# Altium schematic sheet Inductor.SchDoc
size A3; SheetNumber: 34; SheetTotal: 41
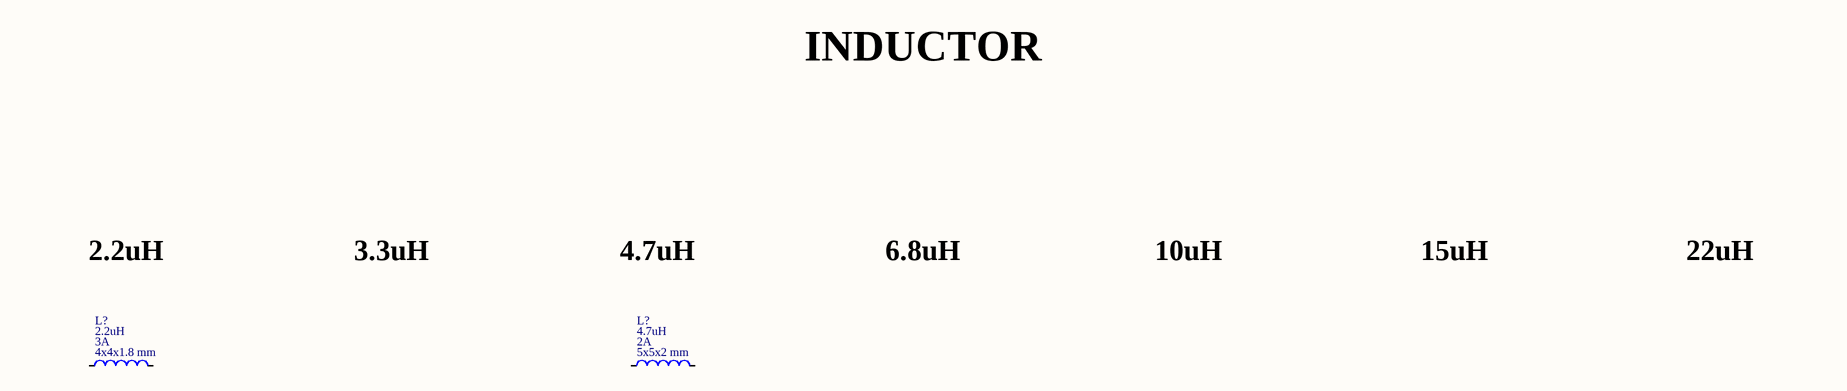
[diagram p0: Inductor.SchDoc]

## Parts
(Parts that share a designator on the sheet are numbered #1, #2 ... from top to bottom, then left to right.)
L?#1  value 2.2uH  Saturation Current: 3A  Package: 4x4x1.8 mm  [Taiyo Yuden - Power Inductor, 4040TK]  (hidden comment: Inductor)
L?#2  value 4.7uH  Saturation Current: 2A  Package: 5x5x2 mm  [Taiyo Yuden - Power Inductor, 5050WK]  (hidden comment: Inductor)

## Nets

Not connected (* = marked no-connect by the designer): L?#1 1 2; L?#2 1 2

## Notes on the sheet
- INDUCTOR
- 2.2uH
- 3.3uH
- 4.7uH
- 6.8uH
- 10uH
- 15uH
- 22uH

## Library data of the parts
L?#1 = Inductor: Inductor, Power, 2.2uH, 3A, 4x4x1.8mm; Manufacturer Part Number: NRS4018T2R2MDGJ; Manufacturer: Taiyo Yuden; ComponentLink1Description: Datasheet; ComponentLink1URL: E:\Altium\Datasheets\Inductor\Taiyo Yuden - NRx Series.pdf; ComponentLink2Description: Supplier Link; ComponentLink2URL: https://www.digikey.com/en/products/detail/taiyo-yuden/NRS4018T2R2MDGJ/2648968; Supplier: Digikey; Supplier Part Number: 587-2890-1-ND; Operating Temperature, Min: -25℃; Operating Temperature, Max: +120℃; Quantity, Min: 1; Quantity, Max: 87500; Price, Min: 0.27; Price, Max: 0.08633; Supplier Currency: $; Supplier Link: https://www.digikey.com/en/products/detail/taiyo-yuden/NRS4018T2R2MDGJ/2648968; Component Type: Power Inductor; Component Category: Inductor
L?#2 = Inductor: Inductor, Power, 4.7uH, 2A, 5x5x2mm; Manufacturer Part Number: NRS5020T4R7MMGJ; Manufacturer: Taiyo Yuden; ComponentLink1Description: Datasheet; ComponentLink1URL: E:\Altium\Datasheets\Inductor\Taiyo Yuden - NRx Series.pdf; ComponentLink2Description: Supplier Link; ComponentLink2URL: https://www.digikey.com/en/products/detail/taiyo-yuden/NRS5020T4R7MMGJ/2230192; Supplier: Digikey; Supplier Part Number: 587-2890-1-ND; Operating Temperature, Min: -25℃; Operating Temperature, Max: +125℃; Quantity, Min: 1; Quantity, Max: 20000; Price, Min: 0.31; Price, Max: 0.1079; Supplier Currency: $; Supplier Link: https://www.digikey.com/en/products/detail/taiyo-yuden/NRS5020T4R7MMGJ/2230192; Component Type: Power Inductor; Component Category: Inductor